# Altium schematic sheet SCHEMATIC.SchDoc
size 431 x 279 mm; SheetNumber: 3; SheetTotal: 3; ENG_APP_DATE: --/--/--; DSN_APP_DATE: --/--/--; CHK_APP_DATE: --/--/--
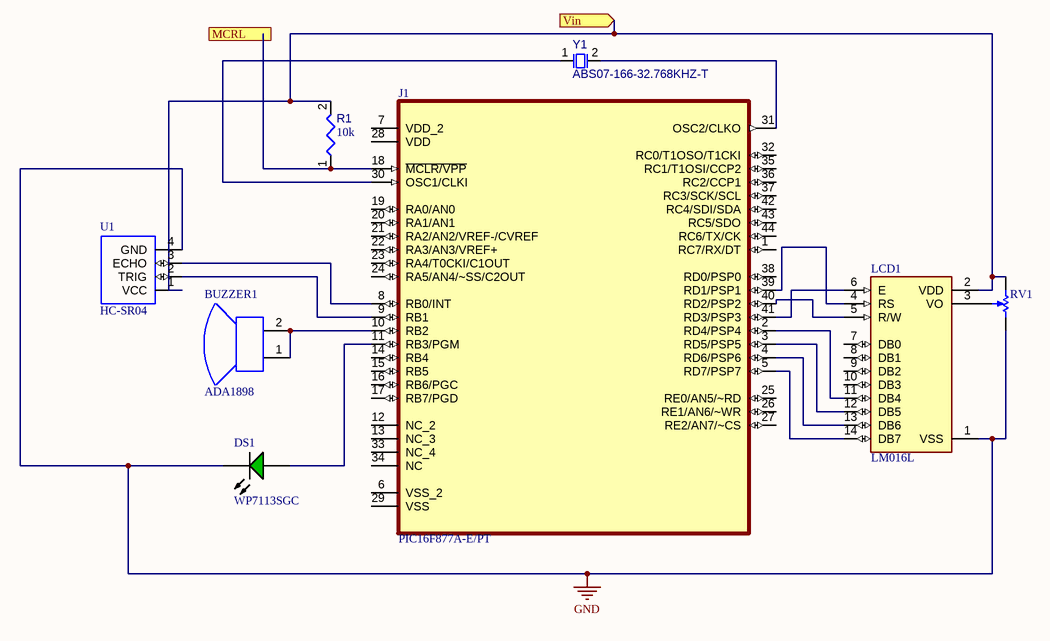
[diagram p0: SCHEMATIC.SchDoc]

## Parts
BUZZER1  ADA1898  [ADAI-ADA1898]
DS1  WP7113SGC  [KING-WP7113SGC_V]
J1  PIC16F877A-E/PT  [QFP80P1200X1200X120-44N]
LCD1  LM016L  [LCD_LM016L]
R1  value 10k  [RESC3216X60X45ML15T20]  (hidden comment: Resistor 10k +/-1% 1206 250 mW)
RV1  TC33X-2-103E  [BOUR-TC33X-2_V]  (value not drawn)
U1  HC-SR04  [XCVR_HC-SR04]
Y1  ABS07-166-32.768KHZ-T  [EPSON-FC-135_V]

## Ports
MCRL (in), Vin (in)

## Nets
GND: DS1.2(K) LCD1.1(VSS) RV1.3 U1.4(GND)
Vin: LCD1.2(VDD) R1.2 RV1.1 U1.1(VCC) ; port Vin
NetBUZZER1_1: BUZZER1.1(+) BUZZER1.2(-) J1.10(RB2)
NetDS1_1: DS1.1(A) J1.11(RB3/PGM)
NetJ1_2: J1.2(RD4/PSP4) LCD1.11(DB4)
NetJ1_3: J1.3(RD5/PSP5) LCD1.12(DB5)
NetJ1_4: J1.4(RD6/PSP6) LCD1.13(DB6)
NetJ1_5: J1.5(RD7/PSP7) LCD1.14(DB7)
NetJ1_8: J1.8(RB0/INT) U1.3(ECHO)
NetJ1_9: J1.9(RB1) U1.2(TRIG)
NetJ1_18: J1.18(~{MCLR/VPP}) R1.1
NetJ1_30: J1.30(OSC1/CLKI) Y1.1
NetJ1_31: J1.31(OSC2/CLKO) Y1.2
NetJ1_39: J1.39(RD1/PSP1) LCD1.4(RS)
NetJ1_40: J1.40(RD2/PSP2) LCD1.5(R/W)
NetJ1_41: J1.41(RD3/PSP3) LCD1.6(E)
NetLCD1_3: LCD1.3(VO) RV1.2

Not connected (* = marked no-connect by the designer): J1 1(RC7/RX/DT) 6(VSS_2) 7(VDD_2) 12(NC_2) 13(NC_3) 14(RB4) 15(RB5) 16(RB6/PGC) 17(RB7/PGD) 19(RA0/AN0) 20(RA1/AN1) 21(RA2/AN2/VREF-/CVREF) 22(RA3/AN3/VREF+) 23(RA4/T0CKI/C1OUT) 24(RA5/AN4/~SS/C2OUT) 25(RE0/AN5/~RD) 26(RE1/AN6/~WR) 27(RE2/AN7/~CS) 28(VDD) 29(VSS) 32(RC0/T1OSO/T1CKI) 33(NC_4) 34(NC) 35(RC1/T1OSI/CCP2) 36(RC2/CCP1) 37(RC3/SCK/SCL) 38(RD0/PSP0) 42(RC4/SDI/SDA) 43(RC5/SDO) 44(RC6/TX/CK); LCD1 7(DB0) 8(DB1) 9(DB2) 10(DB3)

## Notes on the sheet
- DWG. NO.
- REV.
- SHT.
- THIS DOCUMENT AND THE DATA DISCLOSED HEREIN OR HEREWITH IS THE PROPERTY OF ALTIUM LIMITED AND MAY BE FREELY DISTRIBUTED IN WHOLE. NO RIGHTS ARE RESERVED OR EXPRESS OR IMPLIED WARANTEE GIVEN.
- REVISION
- DESCRIPTION
- DATE
- APPROVED
- ENG:
- APPROVALS
- PROJECT
- DSN:
- CHK:
- REFERENCE DOCUMENTS
- PROJECT REVISION:
- TITLE
- DOCUMENT REVISION:
- DESIGN ITEM:
- BOM:
- FAB DWG:
- PCB DWG:
- ASSY DWG:
- SCALE:
- SIZE
- B
- CAGE CODE
- FILE NAME
- DWG NO.
- SHEET
- OF
- REV

## Library data of the parts
BUZZER1 = CMP-00027-00000-1: Mini Speaker, 8 Ohm, 0.2 Wmax, -10 to 40 degC, 2-Pin THD, RoHS; Manufacturer: Adafruit Industries; Mounting Technology: TH; Datasheet URL: https://cdn-shop.adafruit.com/datasheets/P1898.pdf; Package Description: 2-Pin Through Hole Device, Dia 29.3 mm, Pitch 15 mm; Case/Package: ADA1898; Package Reference: ADA1898; Datasheet Version: Mar-14; Manufacturer URL: https://www.adafruit.com/; RoHS Compliant: Unknown
DS1 = CMP-007-00032-2: The Super Bright Green Source Color Device, 2.2 V, -40 to 85 degC, 2-Pin THD, RoHS, Tape and Reel; Manufacturer: Kingbright; Luminous Intensity: 200mcd; Nominal Vf: 2.2V; Viewing Angle: 20degrees; Lens Style: Clear; Mounting Technology: TH; Forward Voltage: 2.2V; Colour: Green; Package Quantity: 1000; Datasheet Version: Rev. 9B, 01/2015; RoHS Compliant: True; Case/Package: Radial; Package Description: 2-Pin Through Hole Device, Dia 5.9 mm, Body Length 8.6 mm; Packaging: Bulk; Illumination Colour: Green; Datasheet URL: http://www.kingbrightusa.com/images/catalog/SPEC/WP7113SGC.pdf; Package Reference: WP7113SGC
J1 = PIC16F877A-E/PT: 7 KB Flash, 368 RAM, 33 I/O44 TQFP 10x10x1mm TRAY | Microchip Technology Inc. PIC16F877A-E/PT; SnapEDA_Link: https://www.snapeda.com/parts/PIC16F877A-E/PT/Microchip/view-part/?ref=snap; Package: TQFP-44 Microchip; Value: *; MF: Microchip; MP: PIC16F877A-E/PT; Check_prices: https://www.snapeda.com/parts/PIC16F877A-E/PT/Microchip/view-part/?ref=eda
LCD1 = LM016L: Display Lcd 35x75mm; MF: Hitachi; Price: None; Availability: Not in stock; Package: None; MP: LM016L; Value: *; SnapEDA_Link: https://www.snapeda.com/parts/LM016L/Hitachi/view-part/?ref=snap; Check_prices: https://www.snapeda.com/parts/LM016L/Hitachi/view-part/?ref=eda
R1 = CMP-009-00016-5: Chip Resistor, 10 KOhm, +/- 1%, 0.25 W, -55 to 155 degC, 1206 (3216 Metric); Power: 250mW; Voltage Rating: 200V; Pins: 2; Max Operating Temperature: 155°C; Tolerance: 1%; RoHS Compliant: True; Case/Package: 1206; Min Operating Temperature: -55°C; Mounting Technology: SM
RV1 = CMP-009-00060-2: Trimming Potentiometer, 1000 Ohm, -40 to 100 degC, 3-Pin SMD, RoHS, Tape and Reel; Manufacturer: Bourns; Tolerance: 25%; Power: 100mW; Resistance: 10k; Max Operating Temperature: 120°C; Package Description: 3-Pin Surface Mount Device, Body 3.8 x 3.6 mm; Datasheet Version: Aug-16; RoHS Compliant: True; Mounting Technology: SM; Package Quantity: 2500; Manufacturer URL: http://www.bourns.com/; Datasheet URL: http://www.bourns.com/docs/Product-Datasheets/TC33.pdf; Case/Package: TC33X-2; Package Reference: TC33X-2; Composition: Potentiometer; Packaging: TapeandReel; Min Operating Temperature: -40°C
U1 = HC-SR04: Ultrasonic Sensor Module; Availability: Unavailable; MP: HC-SR04; Value: *; Price: None; Package: None
Y1 = CMP-003-00029-1: Crystal 32.768kHz 10ppm 7pF -40C +85C; Pins: 2; Frequency: 32.768kHz